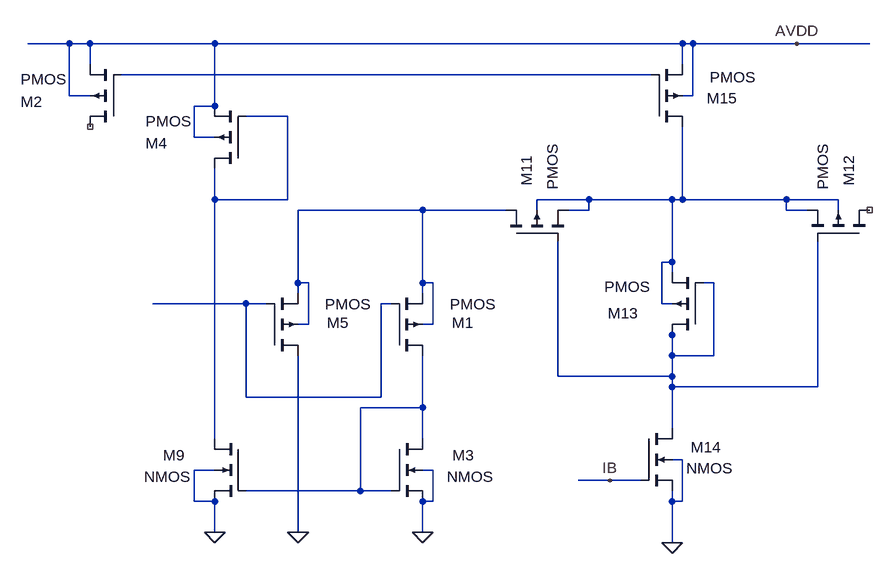
[diagram p0: schematic small_gm_ota.asc]
small_gm_ota.asc, the LTspice schematic file:
Version 4
SHEET 1 1464 788
WIRE -608 0 -672 0
WIRE -576 0 -608 0
WIRE -384 0 -576 0
WIRE 336 0 -384 0
WIRE 352 0 336 0
WIRE 512 0 352 0
WIRE 624 0 512 0
WIRE -576 32 -576 0
WIRE 336 32 336 0
WIRE 288 48 -528 48
WIRE -608 80 -608 0
WIRE -576 80 -608 80
WIRE 352 80 352 0
WIRE 352 80 336 80
WIRE -384 96 -384 0
WIRE -384 96 -416 96
WIRE -272 112 -336 112
WIRE -416 144 -416 96
WIRE -384 144 -416 144
WIRE -384 240 -384 192
WIRE -272 240 -272 112
WIRE -272 240 -384 240
WIRE 192 240 112 240
WIRE 320 240 192 240
WIRE 336 240 336 128
WIRE 336 240 320 240
WIRE 496 240 336 240
WIRE 576 240 496 240
WIRE -64 256 -256 256
WIRE 64 256 -64 256
WIRE 112 256 112 240
WIRE 192 256 192 240
WIRE 192 256 160 256
WIRE 496 256 496 240
WIRE 528 256 496 256
WIRE 576 256 576 240
WIRE 320 336 320 240
WIRE 320 336 304 336
WIRE 320 352 320 336
WIRE -256 368 -256 256
WIRE -240 368 -256 368
WIRE -64 368 -64 256
WIRE -48 368 -64 368
WIRE 384 368 368 368
WIRE -256 384 -256 368
WIRE -64 384 -64 368
WIRE -336 400 -480 400
WIRE -304 400 -336 400
WIRE -112 400 -128 400
WIRE 304 400 304 336
WIRE 320 400 304 400
WIRE -240 432 -240 368
WIRE -240 432 -256 432
WIRE -48 432 -48 368
WIRE -48 432 -64 432
WIRE 320 448 320 432
WIRE 320 480 320 448
WIRE 384 480 384 368
WIRE 384 480 320 480
WIRE 144 512 144 304
WIRE 320 512 320 480
WIRE 320 512 144 512
WIRE 320 528 320 512
WIRE 544 528 544 304
WIRE 544 528 320 528
WIRE -336 544 -336 400
WIRE -128 544 -128 400
WIRE -128 544 -336 544
WIRE -64 560 -64 480
WIRE -64 560 -160 560
WIRE 320 592 320 528
WIRE -384 608 -384 240
WIRE -64 608 -64 560
WIRE 336 640 320 640
WIRE -384 656 -416 656
WIRE -48 656 -64 656
WIRE 224 672 176 672
WIRE 272 672 224 672
WIRE -160 688 -160 560
WIRE -160 688 -336 688
WIRE -112 688 -160 688
WIRE -416 704 -416 656
WIRE -384 704 -416 704
WIRE -48 704 -48 656
WIRE -48 704 -64 704
WIRE 320 704 320 688
WIRE 336 704 336 640
WIRE 336 704 320 704
WIRE -384 752 -384 704
WIRE -256 752 -256 480
WIRE -64 752 -64 704
WIRE 320 768 320 704
FLAG 320 768 0
FLAG 512 0 AVDD
FLAG 224 672 IB
FLAG -64 752 0
FLAG -384 752 0
FLAG -256 752 0
SYMBOL pmos4 288 128 M180
WINDOW 0 85 44 Left 2
WINDOW 3 90 76 Left 2
SYMATTR InstName M15
SYMBOL nmos4 272 592 R0
WINDOW 3 70 61 Left 2
WINDOW 0 77 29 Left 2
SYMATTR InstName M14
SYMBOL pmos4 64 304 R270
WINDOW 0 85 32 Left 2
WINDOW 3 79 72 Left 2
SYMATTR InstName M11
SYMBOL pmos4 368 448 R180
WINDOW 0 100 33 Left 2
WINDOW 3 82 74 Left 2
SYMATTR InstName M13
SYMBOL pmos4 624 304 M270
WINDOW 0 85 32 Left 2
WINDOW 3 79 72 Left 2
SYMATTR InstName M12
SYMBOL pmos4 -112 480 M180
WINDOW 0 93 51 Left 2
WINDOW 3 90 79 Left 2
SYMATTR InstName M1
SYMBOL nmos4 -112 608 R0
WINDOW 3 85 58 Left 2
WINDOW 0 94 25 Left 2
SYMATTR InstName M3
SYMBOL pmos4 -528 128 R180
WINDOW 0 121 39 Left 2
WINDOW 3 84 73 Left 2
SYMATTR InstName M2
SYMBOL pmos4 -336 192 R180
WINDOW 0 121 39 Left 2
WINDOW 3 84 73 Left 2
SYMATTR InstName M4
SYMBOL nmos4 -336 608 M0
WINDOW 3 85 58 Left 2
WINDOW 0 94 25 Left 2
SYMATTR InstName M9
SYMBOL pmos4 -304 480 M180
WINDOW 0 93 51 Left 2
WINDOW 3 90 79 Left 2
SYMATTR InstName M5

The netlist it stands for:
* small_gm_ota.asc
M15 N003 N001 AVDD AVDD PMOS
M14 N005 IB 0 0 NMOS
M11 N004 N005 N003 N003 PMOS
M13 N005 N005 N003 N003 PMOS
M12 NC_01 N005 N003 N003 PMOS
M1 N007 N006 N004 N004 PMOS
M3 N007 N007 0 0 NMOS
M2 NC_02 N001 AVDD AVDD PMOS
M4 N002 N002 AVDD AVDD PMOS
M9 N002 N007 0 0 NMOS
M5 0 N006 N004 N004 PMOS
.model NMOS NMOS
.model PMOS PMOS
.lib standard.mos
.backanno
.end